# EAGLE design buttons (EAGLE 7.1.0)
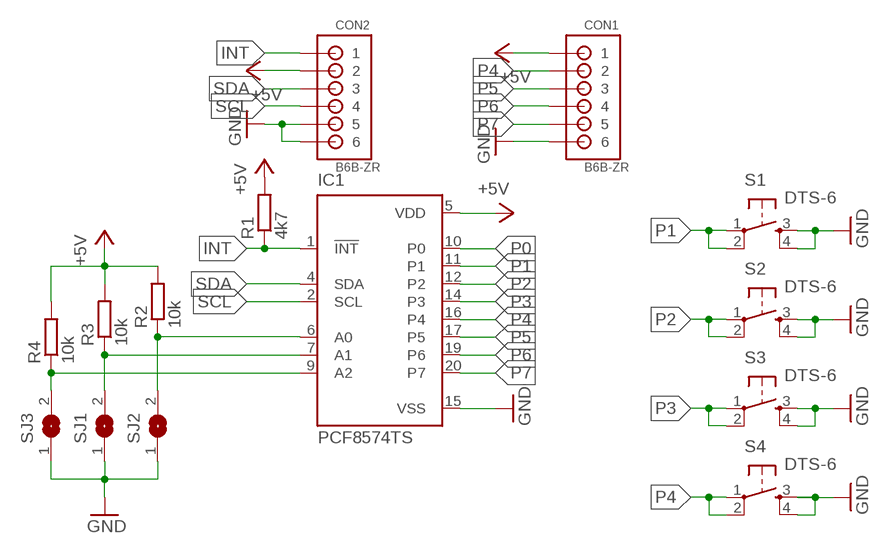
[diagram p0: schematic, sheet 1]

## Parts
CON1  B6B-ZR  [B6B-ZR]
CON2  B6B-ZR  [B6B-ZR]
IC1  PCF8574TS  [SSOP20]
R1  4k7  R-EU_R0805  [R0805]
R2  10k  R-EU_R0805  [R0805]
R3  10k  R-EU_R0805  [R0805]
R4  10k  R-EU_R0805  [R0805]
S1  DTS-6  [DTS-6]
S2  DTS-6  [DTS-6]
S3  DTS-6  [DTS-6]
S4  DTS-6  [DTS-6]
SJ1  SJ  [SJ]
SJ2  SJ  [SJ]
SJ3  SJ  [SJ]

## Nets
+5V: CON1.1 CON2.2 IC1.5(VDD) R1.2 R2.2 R3.2 R4.2
GND: CON1.6 CON2.5 CON2.6 IC1.15(VSS) S1.3 S1.4 S2.3 S2.4 S3.3 S3.4 S4.3 S4.4 SJ1.1 SJ2.1 SJ3.1
INT: CON2.1 IC1.1(!INT) R1.1
N$3: IC1.6(A0) R2.1 SJ2.2
N$4: IC1.7(A1) R3.1 SJ1.2
N$5: IC1.9(A2) R4.1 SJ3.2
P0: IC1.10(P0)
P1: IC1.11(P1) S1.1 S1.2
P2: IC1.12(P2) S2.1 S2.2
P3: IC1.14(P3) S3.1 S3.2
P4: CON1.2 IC1.16(P4) S4.1 S4.2
P5: CON1.3 IC1.17(P5)
P6: CON1.4 IC1.19(P6)
P7: CON1.5 IC1.20(P7)
SCL: CON2.4 IC1.2(SCL)
SDA: CON2.3 IC1.4(SDA)

## Library data of the parts
CON1 CON2 = jst:B6B-ZR: JST-ZH Connector 6 pol, 1.5mm pitch Package: B6B-ZR Source: http://www.jst-mfg.com/product/pdf/eng/eZH.pdf
IC1 = micro-philips:PCF8574: I2C-Bus Remote 8-bit I/O expander http://www.semiconductors.philips.com/acrobat_download/datasheets/PCF8574_4.pdf; MPN: PCF8574TS/3,118; OC_FARNELL: 1506644; OC_NEWARK: 70R6873
R1-R4 = rcl:R-EU_: RESISTOR, European symbol
S1-S4 = switch-tact:DTS-6
SJ1-SJ3 = jumper:SJ: SMD solder JUMPER

## Board
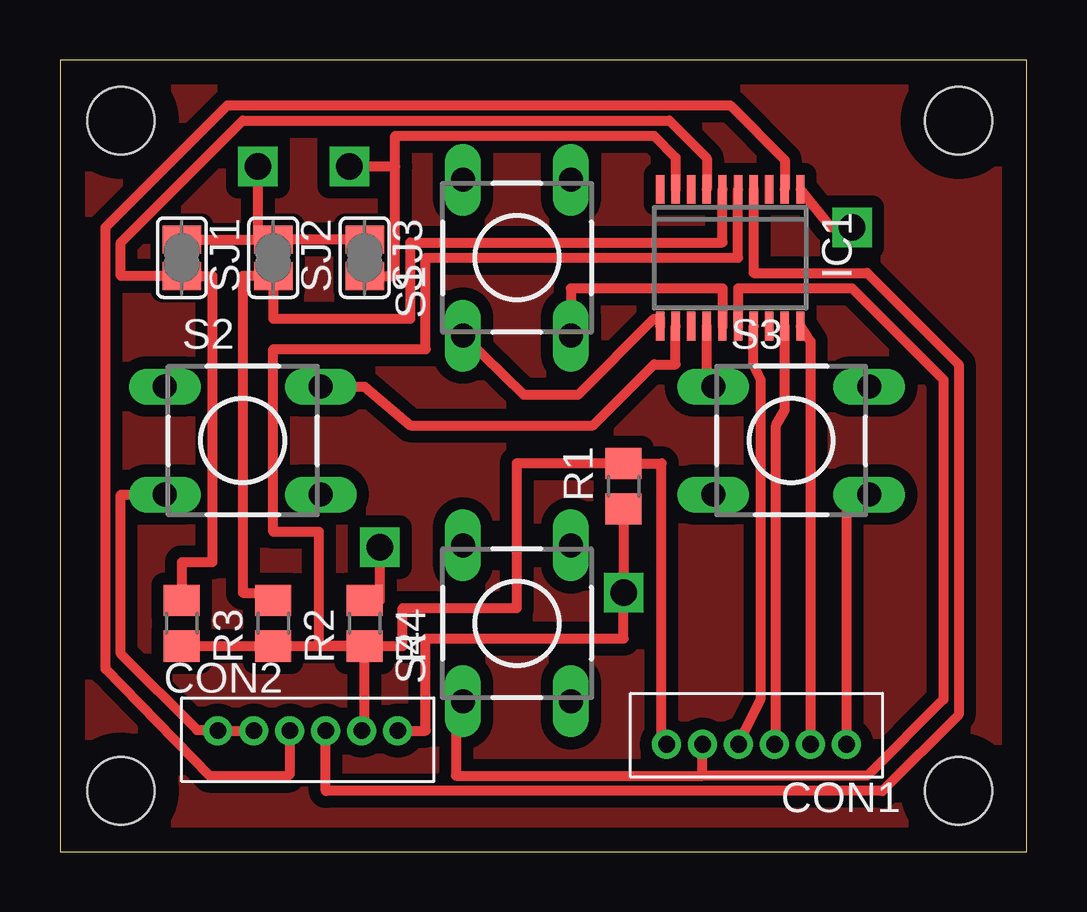
[diagram p1: board, top side]
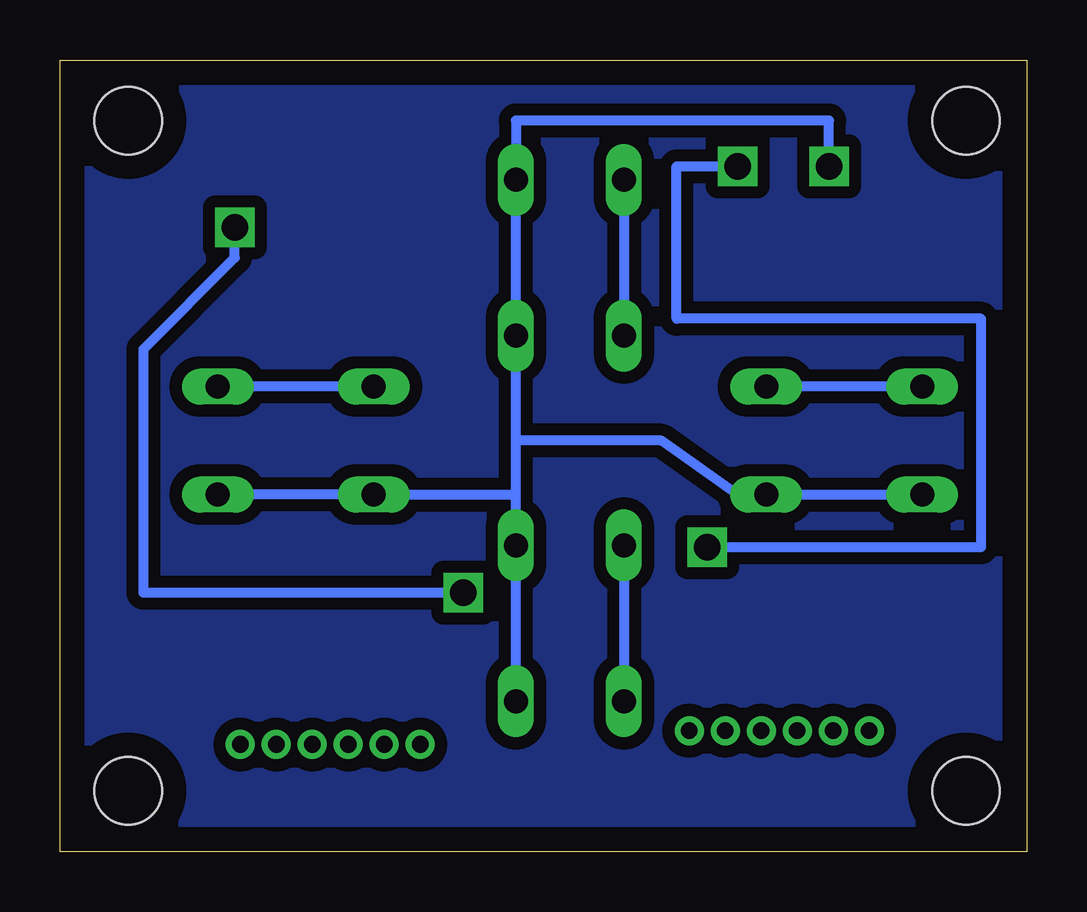
[diagram p2: board, bottom side, seen from below]

Size 40.31 x 33.01 mm. Coordinates in mm from the lower left corner, seen from the top.
Outline: 0,0 40.31,0 40.31,33.01 0,33.01 0,0
Copper layers (1*16): Top 0.035mm / dielectric 1.5mm / Bottom 0.035mm
Design rules "default *": minimum track width 10mil, minimum drill 24mil, track to track 20mil, track to pad 20mil, pad to pad 8mil, via to via 8mil, smd to smd 20mil, copper to edge 40mil, drill to drill 8mil, minimum pad ring 10mil, minimum via ring 8mil, stop-mask expansion 4mil, vias tented up to drill 0mil, thermal gap 10mil
Holes 2.8 mm at 2.54,30.48 37.47,2.54 37.47,30.48 2.54,2.54

### Footprints (pad centres in the part's own frame; a part is rotated, then mirrored left to right if it is on the bottom)
B6B-ZR = drill 0.7: 1 9,-1.3; 2 7.5,-1.3; 3 6,-1.3; 4 4.5,-1.3; 5 3,-1.3; 6 1.5,-1.3
SSOP20 = smd 0.35 x 1.2: 1 -2.925,-2.85; 2 -2.275,-2.85; 3 -1.625,-2.85; 4 -0.975,-2.85; 5 -0.325,-2.85; 6 0.325,-2.85; 7 0.975,-2.85; 8 1.625,-2.85; 9 2.275,-2.85; 10 2.925,-2.85; 11 2.925,2.85; 12 2.275,2.85; 13 1.625,2.85; 14 0.975,2.85; 15 0.325,2.85; 16 -0.325,2.85; 17 -0.975,2.85; 18 -1.625,2.85; 19 -2.275,2.85; 20 -2.925,2.85
R0805 = smd 1.3 x 1.5: 1 -0.95,0; 2 0.95,0
DTS-6 = drill 1 long: 1 -3.25,2.25; 2 3.25,2.25; 3 -3.25,-2.25; 4 3.25,-2.25
SJ = smd 1.168 x 1.6: 1 -0.762,0; 2 0.762,0

### Placement (x,y rotation side)
CON1  34.29,3.17 180 top
CON2  5.08,6.35 0 top
IC1  27.94,24.77 180 top
R1  23.5,15.24 90 top
R2  8.89,9.53 270 top
R3  5.08,9.53 270 top
R4  12.7,9.53 270 top
S1  19.05,24.77 90 top
S2  7.62,17.14 0 top
S3  30.48,17.14 0 top
S4  19.05,9.53 90 top
SJ1  5.08,24.77 270 top
SJ2  8.89,24.77 270 top
SJ3  12.7,24.77 270 top

### Tracks (layer width: path | path; a pad name or v marks a point on that pad's centre or on a via)
+5V
  Top 0.406: R3.2 R2.2 | R2.2 8.6,8.57 | R2.2 R4.2 | R4.2 10.79,8.57 10.79,13.34 8.89,13.34 8.89,20.95 15.24,20.95 15.24,24.77 28.27,24.77 IC1.5 | CON2.2 12.7,5.05 R4.2 | R4.2 14.29,8.57 14.29,10.16 19.05,10.16 19.05,16.2 20.21,16.2 R1.2 25.08,16.19 25.08,4.47 CON1.1
GND  (via drill 1.1)
  Top 0.406: SJ1.1 8.26,25.53 | 8.26,25.53 SJ2.1 SJ3.1 | IC1.15 27.61,23.5 21.3,23.5 S1.3 | S3.4 32.79,14.89 CON1.6 | S2.3 2.54,14.89 2.54,8.26 5.71,5.08 6.55,5.08 CON2.6 CON2.5 | 8.26,25.53 v8.26,28.57
  Bottom 0.406: S2.3 S2.4 12.06,14.89 15.24,17.14 21.3,17.14 | S3.4 S3.3 21.3,14.89 | S4.3 S4.4 21.3,14.89 | 21.3,14.89 21.3,17.14 | 21.3,17.14 S1.3 S1.4 21.3,30.48 8.26,30.48 v8.26,28.57
INT  (via drill 1.1)
  Top 0.406: v33.02,26.04 32.13,26.04 IC1.1 | CON2.1 15.24,5.05 15.24,8.89 23.5,8.89 v23.5,10.79 R1.1
  Bottom 0.406: v23.5,10.79 36.83,10.79 36.83,20.95 33.02,24.77 v33.02,26.04
N$1
  pour Bottom: 0,33.02 40.32,33.02 40.32,0 0,0
N$2
  pour Top: 0,33.02 40.32,33.02 40.32,0 0,0
N$3
  Top 0.406: R2.1 8.89,10.79 7.62,10.79 7.62,24 SJ2.2 8.89,22.23 14.61,22.23 14.61,25.4 27.61,25.4 IC1.6
N$4
  Top 0.406: R3.1 5.08,12.06 6.35,12.06 6.35,24 SJ1.2 2.54,24 2.54,25.4 7.62,30.48 25.4,30.48 26.96,28.91 IC1.7
N$5  (via drill 1.1)
  Top 0.406: SJ3.2 13.97,24 13.97,28.57 | 13.97,28.57 13.97,29.84 24.77,29.84 25.66,28.95 IC1.9 | R4.1 13.34,10.47 v13.34,12.7 | v12.06,28.57 13.97,28.57
  Bottom 0.406: v13.34,12.7 1.91,12.7 1.91,22.23 14.61,22.23 14.61,28.57 v12.06,28.57
P1
  Top 0.406: IC1.11 25.02,22.23 24.77,22.23 21.59,19.05 19.34,19.05 S1.1
  Bottom 0.406: S1.2 S1.1
P2
  Top 0.406: S2.2 12.7,19.39 14.61,17.78 22.23,17.78 24.77,20.32 25.66,20.32 IC1.12
  Bottom 0.406: S2.1 S2.2
P3
  Top 0.406: S3.1 26.96,19.39 IC1.14
  Bottom 0.406: S3.1 S3.2
P4
  Top 0.406: S4.1 16.51,6.28 16.51,3.17 26.79,3.17 | 26.79,3.17 CON1.2 | 26.79,3.17 33.66,3.17 36.83,6.35 36.83,19.68 33.02,23.5 28.27,23.5 IC1.16
  Bottom 0.406: S4.2 S4.1
P5
  Top 0.406: CON1.3 29.21,6.38 29.21,19.68 28.91,20.32 IC1.17
P6
  Top 0.406: CON1.4 29.84,4.47 29.84,17.78 30.21,18.41 IC1.19
P7
  Top 0.406: IC1.20 31.29,21.28 CON1.5
SCL
  Top 0.406: IC1.2 30.21,28.84 27.94,31.11 6.99,31.11 1.91,26.04 1.91,7.62 6.24,3.17 9.53,3.17 9.58,3.23 CON2.4
SDA
  Top 0.406: IC1.4 28.91,24.13 33.66,24.13 37.47,20.32 37.47,5.71 34.29,2.54 11.08,2.54 CON2.3